# EAGLE schematic mattduino.mvp (EAGLE 8.6.1)
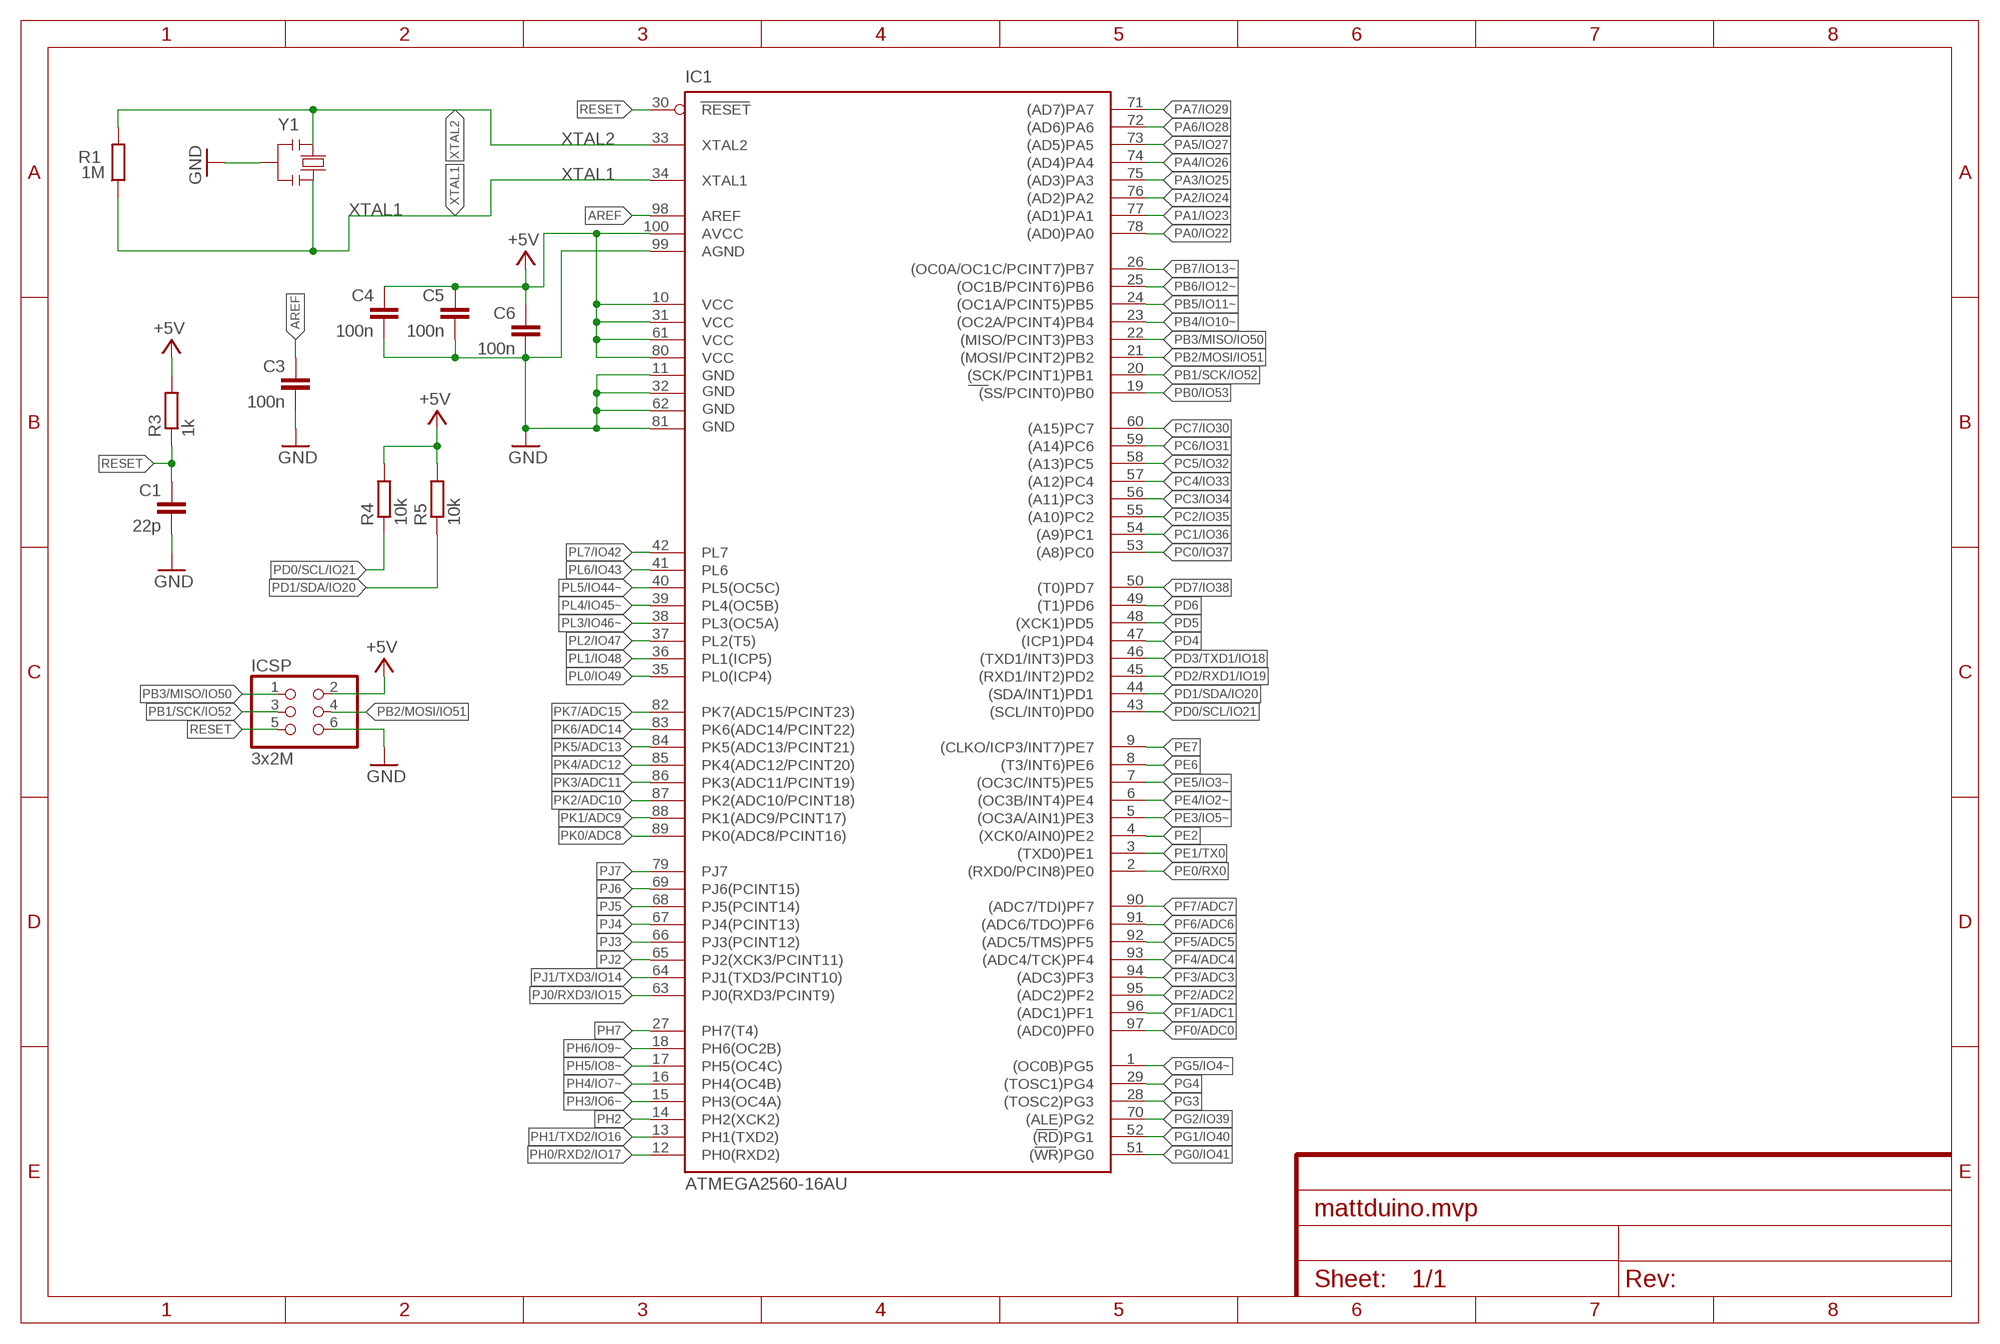
[diagram p0: schematic, sheet 1]

## Parts
C1  22p  C-EUC1206  [C1206]
C3  100n  C-EUC1206  [C1206]
C4  100n  C-EUC1206  [C1206]
C5  100n  C-EUC1206  [C1206]
C6  100n  C-EUC1206  [C1206]
IC1  ATMEGA2560-16AU  ATMEGA25602560-16AU  [TQFP100]
ICSP  3x2M  PINHD-2X3  [2X03]
R1  1M  R-EU_R1206  [R1206]
R3  1k  R-EU_R1206  [R1206]
R4  10k  R-EU_R1206  [R1206]
R5  10k  R-EU_R1206  [R1206]
Y1  CSTCE16M0V53-R0 16MHZ  RESONATORMU  [RESONATOR]

## Nets
+5V [power usb]: C4.1 C5.1 C6.1 IC1.10(VCC) IC1.31(VCC1) IC1.61(VCC2) IC1.80(VCC3) IC1.100(AVCC) ICSP.2 R3.2 R4.2 R5.2
AREF: C3.1 IC1.98(AREF)
GND [gnd]: C1.2 C3.2 C4.2 C5.2 C6.2 IC1.11(GND) IC1.32(GND1) IC1.62(GND2) IC1.81(GND3) IC1.99(AGND) ICSP.6 Y1.2
PA0/IO22: IC1.78((AD0)PA0)
PA1/IO23: IC1.77((AD1)PA1)
PA2/IO24: IC1.76((AD2)PA2)
PA3/IO25: IC1.75((AD3)PA3)
PA4/IO26: IC1.74((AD4)PA4)
PA5/IO27: IC1.73((AD5)PA5)
PA6/IO28: IC1.72((AD6)PA6)
PA7/IO29: IC1.71((AD7)PA7)
PB0/IO53: IC1.19((SS/PCINT0)PB0)
PB1/SCK/IO52: IC1.20((SCK/PCINT1)PB1) ICSP.3
PB2/MOSI/IO51: IC1.21((MOSI/PCINT2)PB2) ICSP.4
PB3/MISO/IO50: IC1.22((MISO/PCINT3)PB3) ICSP.1
PB4/IO10~: IC1.23((OC2A/PCINT4)PB4)
PB5/IO11~: IC1.24((OC1A/PCINT5)PB5)
PB6/IO12~: IC1.25((OC1B/PCINT6)PB6)
PB7/IO13~: IC1.26((OC0A/OC1C/PCINT7)PB7)
PC0/IO37: IC1.53((A8)PC0)
PC1/IO36: IC1.54((A9)PC1)
PC2/IO35: IC1.55((A10)PC2)
PC3/IO34: IC1.56((A11)PC3)
PC4/IO33: IC1.57((A12)PC4)
PC5/IO32: IC1.58((A13)PC5)
PC6/IO31: IC1.59((A14)PC6)
PC7/IO30: IC1.60((A15)PC7)
PD0/SCL/IO21: IC1.43((SCL/INT0)PD0) R4.1
PD1/SDA/IO20: IC1.44((SDA/INT1)PD1) R5.1
PD2/RXD1/IO19: IC1.45((RXD1/INT2)PD2)
PD3/TXD1/IO18: IC1.46((TXD1/INT3)PD3)
PD4: IC1.47((ICP1)PD4)
PD5: IC1.48((XCK1)PD5)
PD6: IC1.49((T1)PD6)
PD7/IO38: IC1.50((T0)PD7)
PE0/RX0: IC1.2((RXD0/PCIN8)PE0)
PE1/TX0: IC1.3((TXD0)PE1)
PE2: IC1.4((XCK0/AIN0)PE2)
PE3/IO5~: IC1.5((OC3A/AIN1)PE3)
PE4/IO2~: IC1.6((OC3B/INT4)PE4)
PE5/IO3~: IC1.7((OC3C/INT5)PE5)
PE6: IC1.8((T3/INT6)PE6)
PE7: IC1.9((CLKO/ICP3/INT7)PE7)
PF0/ADC0: IC1.97((ADC0)PF0)
PF1/ADC1: IC1.96((ADC1)PF1)
PF2/ADC2: IC1.95((ADC2)PF2)
PF3/ADC3: IC1.94((ADC3)PF3)
PF4/ADC4: IC1.93((ADC4/TCK)PF4)
PF5/ADC5: IC1.92((ADC5/TMS)PF5)
PF6/ADC6: IC1.91((ADC6/TDO)PF6)
PF7/ADC7: IC1.90((ADC7/TDI)PF7)
PG0/IO41: IC1.51((WR)PG0)
PG1/IO40: IC1.52((RD)PG1)
PG2/IO39: IC1.70((ALE)PG2)
PG3: IC1.28((TOSC2)PG3)
PG4: IC1.29((TOSC1)PG4)
PG5/IO4~: IC1.1((OC0B)PG5)
PH0/RXD2/IO17: IC1.12(PH0(RXD2))
PH1/TXD2/IO16: IC1.13(PH1(TXD2))
PH2: IC1.14(PH2(XCK2))
PH3/IO6~: IC1.15(PH3(OC4A))
PH4/IO7~: IC1.16(PH4(OC4B))
PH5/IO8~: IC1.17(PH5(OC4C))
PH6/IO9~: IC1.18(PH6(OC2B))
PH7: IC1.27(PH7(T4))
PJ0/RXD3/IO15: IC1.63(PJ0(RXD3/PCINT9))
PJ1/TXD3/IO14: IC1.64(PJ1(TXD3/PCINT10))
PJ2: IC1.65(PJ2(XCK3/PCINT11))
PJ3: IC1.66(PJ3(PCINT12))
PJ4: IC1.67(PJ4(PCINT13))
PJ5: IC1.68(PJ5(PCINT14))
PJ6: IC1.69(PJ6(PCINT15))
PJ7: IC1.79(PJ7)
PK0/ADC8: IC1.89(PK0(ADC8/PCINT16))
PK1/ADC9: IC1.88(PK1(ADC9/PCINT17))
PK2/ADC10: IC1.87(PK2(ADC10/PCINT18))
PK3/ADC11: IC1.86(PK3(ADC11/PCINT19))
PK4/ADC12: IC1.85(PK4(ADC12/PCINT20))
PK5/ADC13: IC1.84(PK5(ADC13/PCINT21))
PK6/ADC14: IC1.83(PK6(ADC14/PCINT22))
PK7/ADC15: IC1.82(PK7(ADC15/PCINT23))
PL0/IO49: IC1.35(PL0(ICP4))
PL1/IO48: IC1.36(PL1(ICP5))
PL2/IO47: IC1.37(PL2(T5))
PL3/IO46~: IC1.38(PL3(OC5A))
PL4/IO45~: IC1.39(PL4(OC5B))
PL5/IO44~: IC1.40(PL5(OC5C))
PL6/IO43: IC1.41(PL6)
PL7/IO42: IC1.42(PL7)
RESET: C1.1 IC1.30(RESET) ICSP.5 R3.1
XTAL1: IC1.34(XTAL1) R1.1 Y1.3
XTAL2: IC1.33(XTAL2) R1.2 Y1.1

## Library data of the parts
C1 C3-C6 = rcl:C-EU: CAPACITOR, European symbol; SPICEPREFIX: C
IC1 = SmartPrj:ATMEGA2560: MICROCONTROLLER 64/128/256 Kbytes FLASH 4 Kbytes EEPROM 8 Kbytes SRAM 86 General Purpose I/O pins 12-channels16-bit PWM 4 x Serial USARTs 16-channels 10-bit A/D
ICSP = SmartPrj:PINHD-2X3: PIN HEADER
R1 R3-R5 = rcl:R-EU_: RESISTOR, European symbol; SPICEPREFIX: R
Y1 = SmartPrj:RESONATOR

## Net classes
2 gnd: width 0.305 mm, drill 0.406 mm, clearance 0.203 mm
3 power usb: width 0.508 mm, drill 0.406 mm, clearance 0.203 mm